# EAGLE design Ringer (EAGLE 9.6.2)
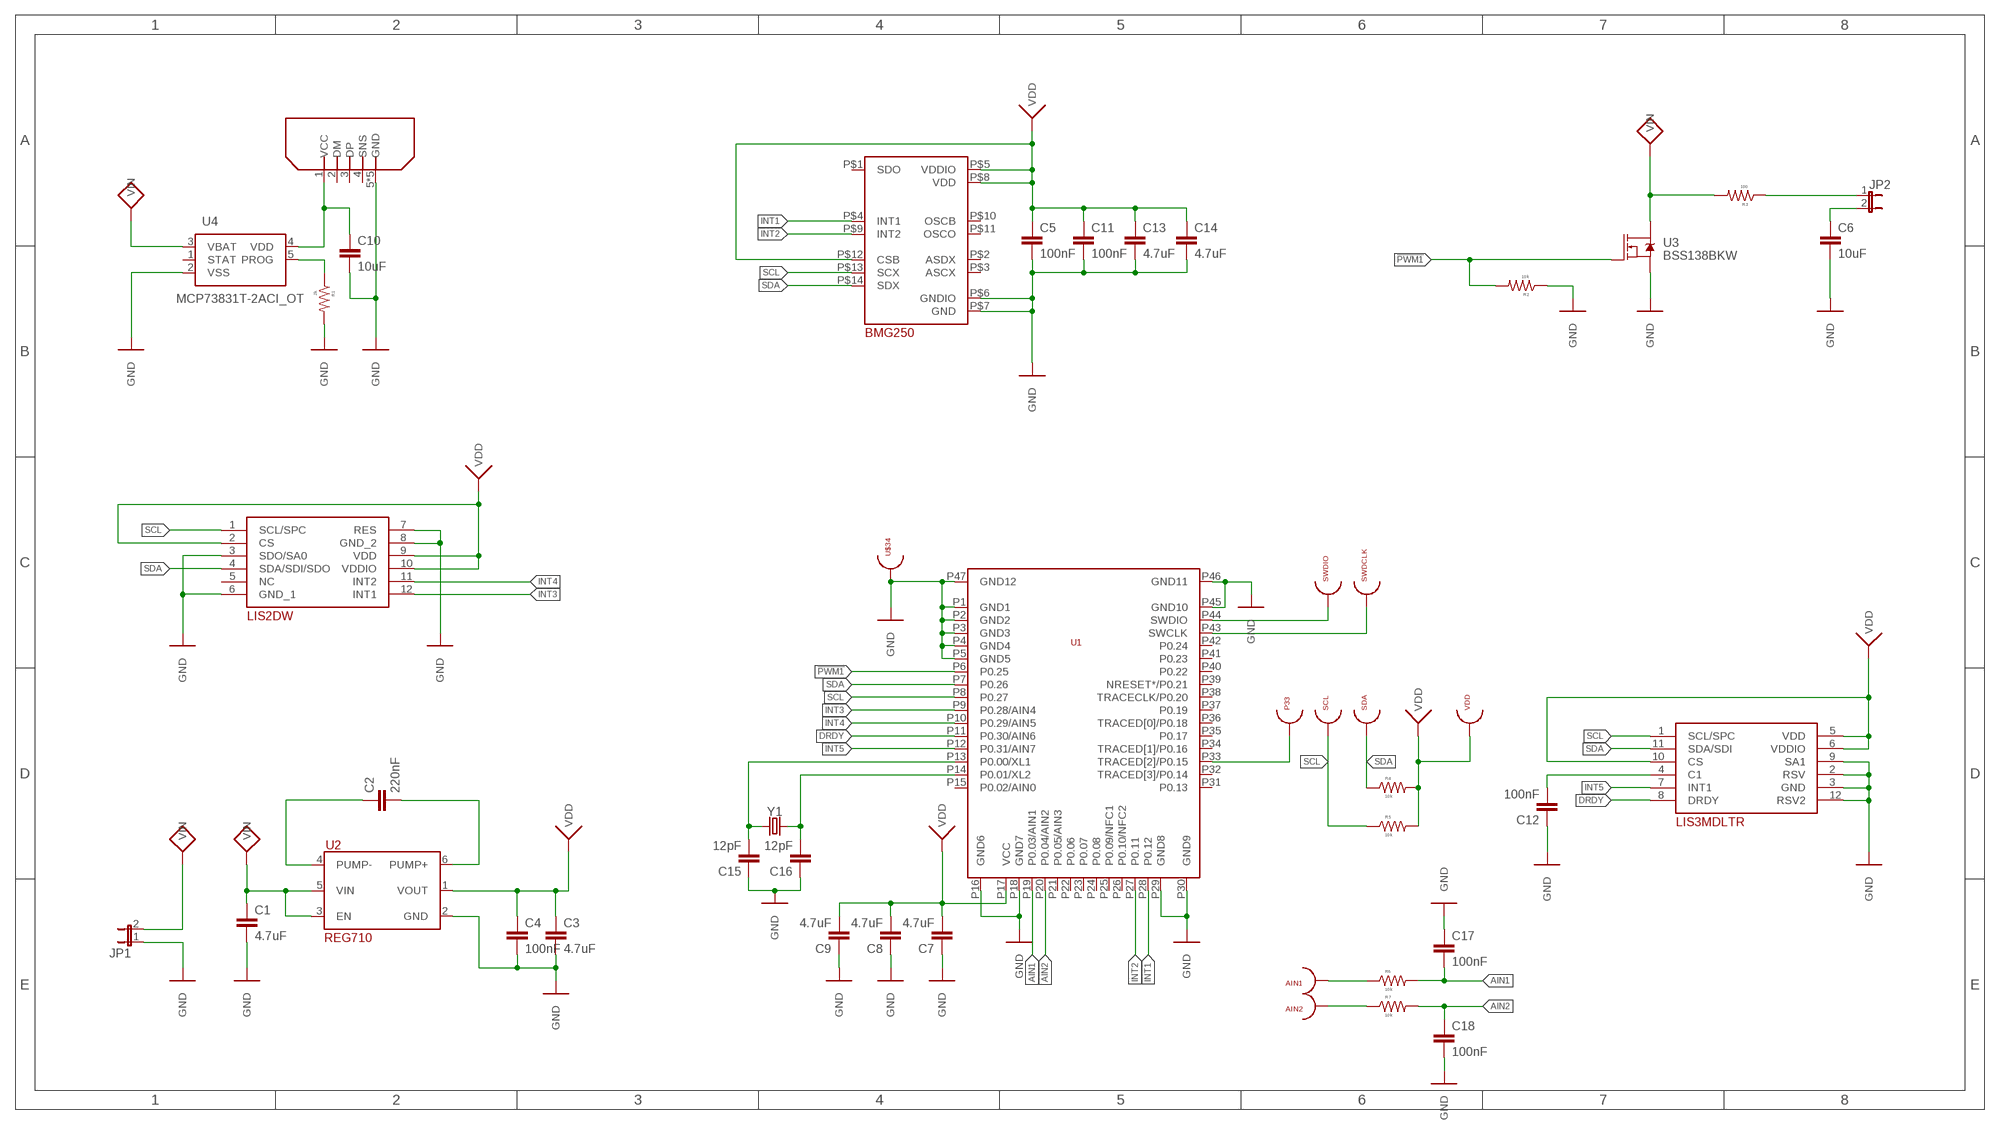
[diagram p0: schematic, sheet 1]

## Parts
AIN1  TESTPOINT_22  [TESTPOINT_22]
AIN2  TESTPOINT_22  [TESTPOINT_22]
C1  4.7uF  CAPACITOR0603  [C0603]
C2  220nF  CAPACITOR0603  [C0603]
C3  4.7uF  CAPACITOR0603  [C0603]
C4  100nF  CAPACITOR0603  [C0603]
C5  100nF  CAPACITOR0603  [C0603]
C6  10uF  CAPACITOR0805  [C0805]
C7  4.7uF  CAPACITOR0603  [C0603]
C8  4.7uF  CAPACITOR0603  [C0603]
C9  4.7uF  CAPACITOR0603  [C0603]
C10  10uF  CAPACITOR0603  [C0603]
C11  100nF  CAPACITOR0603  [C0603]
C12  100nF  CAPACITOR0603  [C0603]
C13  4.7uF  CAPACITOR0603  [C0603]
C14  4.7uF  CAPACITOR0603  [C0603]
C15  12pF  CAPACITOR0603  [C0603]
C16  12pF  CAPACITOR0603  [C0603]
C17  100nF  CAPACITOR0603  [C0603]
C18  100nF  CAPACITOR0603  [C0603]
IC1  LIS2DW12TR  [LGA-12]
JP1  JP1E  [JP1]
JP2  JP1E  [JP1]
P33  TESTPOINT_22  [TESTPOINT_22]
R1  2k  RESISTOR0603  [R0603]
R2  10k  RESISTOR0603  [R0603]
R3  100  RESISTOR0805  [R0805]
R4  10k  RESISTOR0603  [R0603]
R5  10k  RESISTOR0603  [R0603]
R6  10k  RESISTOR0603  [R0603]
R7  10k  RESISTOR0603  [R0603]
SCL  TESTPOINT_22  [TESTPOINT_22]
SDA  TESTPOINT_22  [TESTPOINT_22]
SWDCLK  TESTPOINT_22  [TESTPOINT_22]
SWDIO  TESTPOINT_22  [TESTPOINT_22]
U1  BMD-300  [BMD-300]
U2  REG710  [SOT457]
U3  BSS138BKW  [SOT65P210X110-3N]
U4  MCP73831T-2ACI_OT  [SOT95P270X145-5N]
U5  BMG250  [LGA14]
U$23  ZX80B5P  [ZX80B5P]
U$29  LIS3MDLTR  [LGA-12]
U$34  TESTPOINT_22  [TESTPOINT_22]
VDD  TESTPOINT_22  [TESTPOINT_22]
Y1  CRYSTALSMD-3.2X1.5  [CRYSTAL-SMD-3.2X1.5MM]

## Nets
!PWM1: R2.2 U1.P6(P0.25) U3.1(G)
AIN1: C17.2 R6.2 U1.P19(P0.03/AIN1)
AIN2: C18.1 R7.2 U1.P20(P0.04/AIN2)
DRDY: U1.P11(P0.30/AIN6) U$29.8(DRDY)
GND: C1.2 C3.2 C4.2 C5.2 C6.2 C7.1 C8.1 C9.1 C10.2 C11.2 C12.1 C13.2 C14.2 C15.1 C16.1 C17.1 C18.2 IC1.3(SDO/SA0) IC1.6(GND_1) IC1.7(RES) IC1.8(GND_2) JP1.1 R1.2 R2.1 U1.P1(GND1) U1.P2(GND2) U1.P3(GND3) U1.P4(GND4) U1.P5(GND5) U1.P16(GND6) U1.P18(GND7) U1.P29(GND8) U1.P30(GND9) U1.P45(GND10) U1.P46(GND11) U1.P47(GND12) U2.2(GND) U3.2(S) U4.2(VSS) U5.P$6(GNDIO) U5.P$7(GND) U$23.5(GND) U$23.GND1(GND) U$23.GND2(GND) U$23.GND3(GND) U$23.GND4(GND) U$29.2(RSV) U$29.3(GND) U$29.9(SA1) U$29.12(RSV2) U$34.P$1
INT1: U1.P28(P0.12) U5.P$4(INT1)
INT2: U1.P27(P0.11) U5.P$9(INT2)
INT3: IC1.12(INT1) U1.P9(P0.28/AIN4)
INT4: IC1.11(INT2) U1.P10(P0.29/AIN5)
INT5: U1.P12(P0.31/AIN7) U$29.7(INT1)
N$1: C6.1 JP2.2
N$2: JP2.1 R3.1
N$3: C2.1 U2.4(PUMP-)
N$4: C2.2 U2.6(PUMP+)
N$5: C10.1 U4.4(VDD) U$23.1(VCC)
N$6: C15.2 U1.P13(P0.00/XL1) Y1.P$1
N$7: R1.1 U4.5(PROG)
N$8: C12.2 U$29.4(C1)
N$9: C16.2 U1.P14(P0.01/XL2) Y1.P$2
N$10: P33.P$1 U1.P33(TRACED[2]/P0.15)
N$12: AIN2.P$1 R7.1
N$13: AIN1.P$1 R6.1
SCL: IC1.1(SCL/SPC) R5.1 SCL.P$1 U1.P8(P0.27) U5.P$13(SCX) U$29.1(SCL/SPC)
SDA: IC1.4(SDA/SDI/SDO) R4.1 SDA.P$1 U1.P7(P0.26) U5.P$14(SDX) U$29.11(SDA/SDI)
SWCLK: SWDCLK.P$1 U1.P43(SWCLK)
SWDIO: SWDIO.P$1 U1.P44(SWDIO)
VDD: C3.1 C4.1 C5.1 C7.2 C8.2 C9.2 C11.1 C13.1 C14.1 IC1.2(CS) IC1.9(VDD) IC1.10(VDDIO) R4.2 R5.2 U1.P17(VCC) U2.1(VOUT) U5.P$5(VDDIO) U5.P$8(VDD) U5.P$12(CSB) U$29.5(VDD) U$29.6(VDDIO) U$29.10(CS) VDD.P$1
VIN: C1.1 JP1.2 R3.2 U2.3(EN) U2.5(VIN) U3.3(D) U4.3(VBAT)
Unconnected: IC1.5(NC) U1.P15(P0.02/AIN0) U1.P21(P0.05/AIN3) U1.P22(P0.06) U1.P23(P0.07) U1.P24(P0.08) U1.P25(P0.09/NFC1) U1.P26(P0.10/NFC2) U1.P31(P0.13) U1.P32(TRACED[3]/P0.14) U1.P34(TRACED[1]/P0.16) U1.P35(P0.17) U1.P36(TRACED[0]/P0.18) U1.P37(P0.19) U1.P38(TRACECLK/P0.20) U1.P39(NRESET*/P0.21) U1.P40(P0.22) U1.P41(P0.23) U1.P42(P0.24) U4.1(STAT) U5.P$1(SDO) U5.P$2(ASDX) U5.P$3(ASCX) U5.P$10(OSCB) U5.P$11(OSCO) U$23.2(DM) U$23.3(DP) U$23.4(SNS)

## Library data of the parts
AIN1 AIN2 P33 SCL SDA SWDCLK SWDIO U$34 VDD = test_points:TESTPOINT_22
C1-C18 = Passives:CAPACITOR: Capacitor
IC1 = Accelerometers:LIS2DW12TR: Accelerometers MEMS digital output motion sensor:high-performance ultra-low-power 3-axis "femto" accelerometer Source: Datasheet <https://componentsearchengine.com/Datasheets/1/LIS2DW12TR.pdf>; DESCRIPTION: Accelerometers MEMS digital output motion sensor:high-performance ultra-low-power 3-axis "femto" accelerometer; HEIGHT: mm; MANUFACTURER_NAME: STMicroelectronics; MANUFACTURER_PART_NUMBER: LIS2DW12TR; MOUSER_PART_NUMBER: 511-LIS2DW12TR; MOUSER_PRICE-STOCK: https://www.mouser.com/Search/Refine.aspx?Keyword=511-LIS2DW12TR
JP1 JP2 = jumper:JP1E: JUMPER
R1-R7 = Passives:RESISTOR: Resistor
U1 = Rigado:BMD-300
U2 = DCDC:REG710: REG710xx Buck-Boost Charge Pump with up to 60-mA Output Current
U3 = BSS138:BSS138BKW: N-channel Trench MOSFET; MPN: BSS138BKW; OC_FARNELL: 2053836; OC_NEWARK: 61T7488; PACKAGE: SOT-23-3; SUPPLIER: NXP
U4 = Battery:MCP73831T-2ACI_OT: Li-Ion Charge Controller 4.2V SOT23-5 Source: Datasheet <http://ww1.microchip.com/downloads/en/DeviceDoc/20001984g.pdf>; DESCRIPTION: Li-Ion Charge Controller 4.2V SOT23-5; HEIGHT: 1.45mm; MANUFACTURER_NAME: Microchip; MANUFACTURER_PART_NUMBER: MCP73831T-2ACI/OT; MOUSER_PART_NUMBER: 579-MCP73831T-2ACIOT; MOUSER_PRICE-STOCK: https://www.mouser.co.uk/ProductDetail/Microchip-Technology/MCP73831T-2ACI-OT?qs=yUQqVecv4qvbBQBGbHx0Mw%3D%3D
U5 = Gyroscopes:BMG250
U$23 = USB:ZX80B5P
U$29 = Accelerometers:LIS3MDLTR: The LIS3MDL is an ultra-low-power highperformance three-axis magnetic sensor. The LIS3MDL has user-selectable full scales of ±4/8/12/16 gauss. The self-test capability allows the user to check the functioning of the sensor in the final application. The device may be configured to generate interrupt signals for magnetic field detection. The LIS3MDL includes an I2C serial bus interface that supports standard and fast mode (100 kHz and 400 kHz) and SPI serial standard interface. The LIS3MDL is available in a small thin plastic land grid array package (LGA) and is guaranteed to operate over an extended temperature range of -40 °C to +85 °C.
Y1 = SparkFun-Clocks:CRYSTAL: Crystals (Generic) These are passive quartz crystals, which can be used as a clock source for a microcontroller. Crystal's are two-terminal devices. They require external "load" capacitors to generate an oscillating signal.

## Board
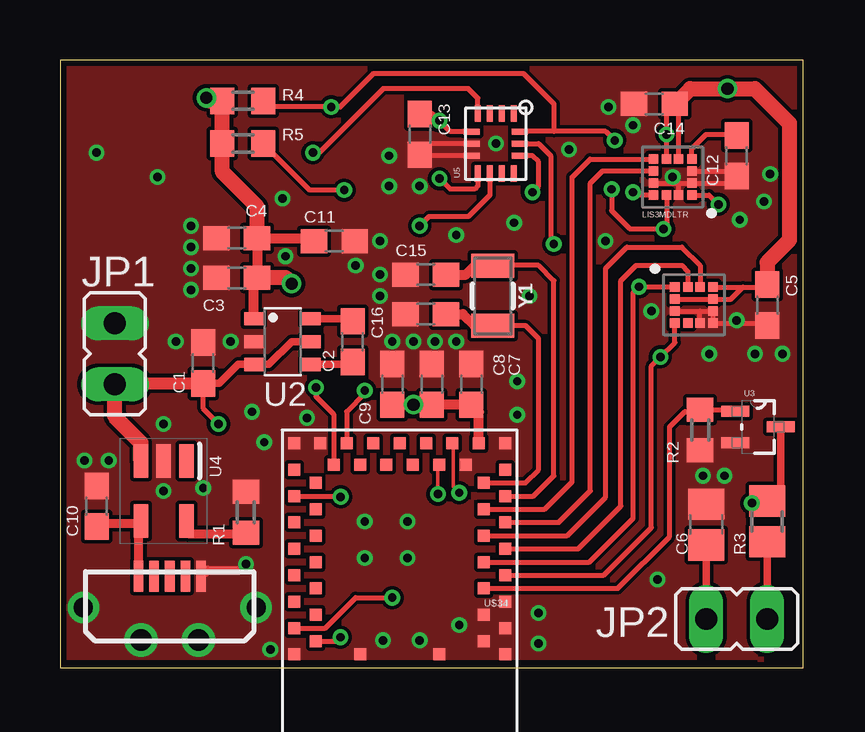
[diagram p1: board, top side]
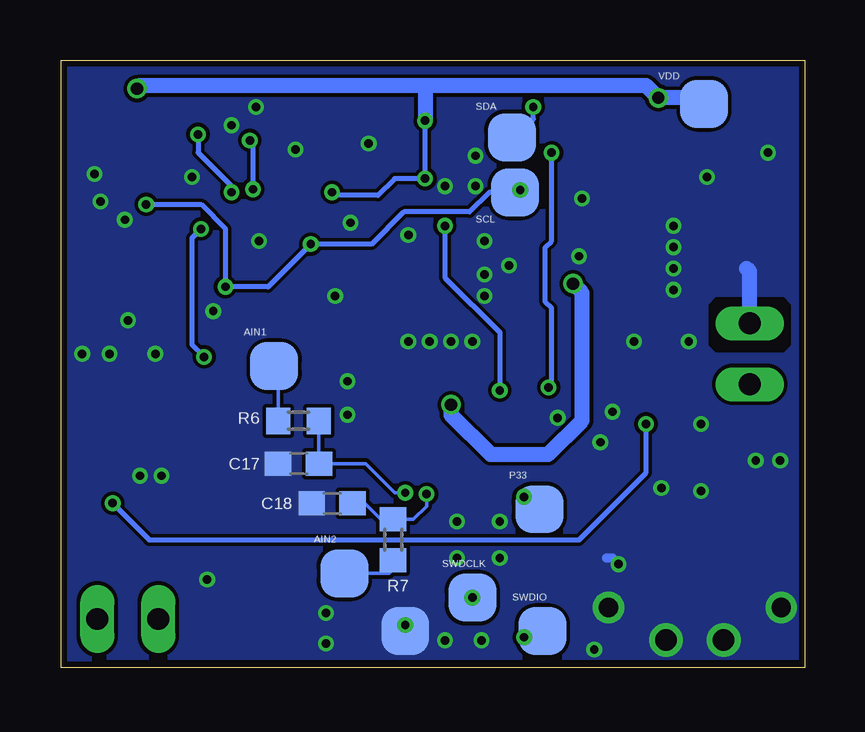
[diagram p2: board, bottom side, seen from below]

Size 30.97 x 25.32 mm. Coordinates in mm from the lower left corner, seen from the top.
Outline: 0,0 30.97,0 30.97,25.32 0,25.32 0,0
Copper layers (1*16): Top 0.035mm / dielectric 1.5mm / Bottom 0.035mm
Design rules "SeeedStudio_2layer_DRU_no_angle_20140221": minimum track width 6mil, minimum drill 12mil, track to track 6mil, track to pad 6mil, pad to pad 6mil, via to via 6mil, smd to smd 0mil, copper to edge 10mil, drill to drill 10mil, minimum pad ring 10mil, minimum via ring 6mil, stop-mask expansion 2mil, vias tented up to drill 100mil, thermal gap 10mil

### Footprints (pad centres in the part's own frame; a part is rotated, then mirrored left to right if it is on the bottom)
TESTPOINT_22 = smd 2 x 2: P$1 0,0
C0603 = smd 1.1 x 1: 1 -0.85,0; 2 0.85,0
C0805 = smd 1.3 x 1.5: 1 -0.85,0; 2 0.85,0
LGA-12 = smd 0.4 x 0.4: 1 -0.8,0.75; 2 -0.8,0.25; 3 -0.8,-0.25; 4 -0.8,-0.75; 5 -0.25,-0.75; 6 0.25,-0.75; 7 0.8,-0.75; 8 0.8,-0.25; 9 0.8,0.25; 10 0.8,0.75; 11 0.25,0.75; 12 -0.25,0.75
JP1 = drill 0.914 long: 1 0,-1.27; 2 0,1.27
R0603 = smd 1 x 1.1: 1 -0.85,0; 2 0.85,0
R0805 = smd 1.3 x 1.5: 1 -0.85,0; 2 0.85,0
BMD-300 = smd 0.5 x 0.5: P1 0.5,9.35; P2 1.4,8.8; P3 0.5,8.25; P4 1.4,7.7; P5 0.5,7.15; P6 1.4,6.6; P7 0.5,6.05; P8 1.4,5.5; P9 0.5,4.95; P10 1.4,4.4; P11 0.5,3.85; P12 1.4,3.3; P13 0.5,2.75; P14 1.4,2.2; P15 0.5,1.65; P16 0.5,0.55; P17 1.6,0.55; P18 2.15,1.45; P19 2.7,0.55; P20 3.25,1.45; P21 3.8,0.55; P22 4.35,1.45; P23 4.9,0.55; P24 5.45,1.45; P25 6,0.55; P26 6.55,1.45; P27 7.1,0.55; P28 7.65,1.45; P29 8.2,0.55; P30 9.3,0.55; P31 9.3,1.65; P32 8.4,2.2; P33 9.3,2.75; P34 8.4,3.3; P35 9.3,3.85; P36 8.4,4.4; P37 9.3,4.95; P38 8.4,5.5; P39 9.3,6.05; P40 8.4,6.6; P41 9.3,7.15; P42 8.4,7.7; P43 9.3,8.25; P44 8.4,8.8; P45 9.3,9.35; P46 6.55,9.35; P47 3.25,9.35
SOT457 = smd 0.55 x 0.8: 1 -0.95,-1.2; 2 0,-1.2; 3 0.95,-1.2; 4 0.95,1.2; 5 0,1.2; 6 -0.95,1.2
SOT65P210X110-3N = smd 1.168 x 0.457: 1 -0.94,0.66; 2 -0.94,-0.66; 3 0.94,0
SOT95P270X145-5N = smd 1.4 x 0.6: 1 -1.25,0.95; 2 -1.25,0; 3 -1.25,-0.95; 4 1.25,-0.95; 5 1.25,0.95
LGA14 = smd 0.675 x 0.25: P$1 -1.25,0.75; P$2 -1.25,0.25; P$3 -1.25,-0.25; P$4 -1.25,-0.75; P$8 1.25,-0.75; P$9 1.25,-0.25; P$10 1.25,0.25; P$11 1.25,0.75 | smd 0.25 x 0.675: P$5 -0.5,-1; P$6 0,-1; P$7 0.5,-1; P$12 0.5,1; P$13 0,1; P$14 -0.5,1
ZX80B5P = smd 0.4 x 1.3: 1 -1.3,0; 2 -0.65,0; 3 0,0; 4 0.65,0; 5 1.3,0 | drill 0.8: GND1 3.6,-1.3; GND4 -3.6,-1.3 | drill 0.9: GND2 -1.2,-2.65; GND3 1.2,-2.65
CRYSTAL-SMD-3.2X1.5MM = smd 1 x 1.8: P$1 -1.25,0; P$2 1.25,0

### Placement (x,y rotation side)
AIN1  22.1,12.57 0 bottom
AIN2  19.18,3.94 0 bottom
C1  5.97,12.7 90 top
C2  12.19,13.59 90 top
C3  7.37,16.26 180 top
C4  7.37,17.91 180 top
C5  29.46,15.11 270 top
C6  26.92,5.97 90 top
C7  17.14,11.81 270 top
C8  15.49,11.81 270 top
C9  13.84,11.81 270 top
C10  1.52,6.73 90 top
C11  11.43,17.78 0 top
C12  28.19,21.34 90 top
C13  14.99,22.23 270 top
C14  24.77,23.5 180 top
C15  15.24,16.38 0 top
C16  15.24,14.73 0 top
C17  21.08,8.51 0 bottom
C18  19.68,6.86 180 bottom
IC1  26.42,15.11 0 top
JP1  2.29,13.08 180 top
JP2  28.19,2.03 90 top
P33  11.05,6.6 0 bottom
R1  7.75,6.48 90 top
R2  26.67,9.91 90 top
R3  29.46,6.1 90 top
R4  7.62,23.62 180 top
R5  7.62,21.84 180 top
R6  21.08,10.29 0 bottom
R7  17.14,5.33 90 bottom
SCL  12.06,19.81 0 bottom
SDA  12.19,22.1 0 bottom
SWDCLK  13.84,2.92 0 bottom
SWDIO  10.92,1.52 0 bottom
U1  19.05,9.91 180 top
U2  9.27,13.59 270 top
U3  29.08,10.03 0 top
U4  4.32,7.37 270 top
U5  18.16,21.84 270 top
U$23  4.57,3.81 0 top
U$29  25.53,20.45 180 top
U$34  16.64,1.52 0 bottom
VDD  4.19,23.5 0 bottom
Y1  18.03,15.49 270 top

### Tracks (layer width: path | path; a pad name or v marks a point on that pad's centre or on a via)
!PWM1
  Top 0.203: U1.P6 23.25,3.31 25.4,5.46 25.4,10.03 26.04,10.67 26.58,10.67 R2.2 28.08,10.76 U3.1
AIN1  (via drill 0.35)
  Top 0.152: U1.P19 16.38,9.32 16.38,7.54 v16.64,7.29
  Bottom 0.152: v16.64,7.29 17.07,7.29 18.29,8.51 C17.2 R6.2
AIN2  (via drill 0.35)
  Top 0.152: v15.75,7.24 15.75,8.4 U1.P20
  Bottom 0.152: v15.75,7.24 15.75,6.73 16.3,6.18 R7.2 17.65,6.18 18.33,6.86 C18.1
DRDY
  Top 0.203: U1.P11 20.79,6.06 22.1,7.37 22.1,20.19 22.61,20.7 U$29.8
GND  (via drill 0.35)
  Top 0.203: IC1.3 26.67,14.86 | 26.67,14.86 IC1.8 IC1.7 29.36,14.36 C5.2 | IC1.6 26.67,14.86 | U$29.3 27.98,20.7 C12.1 27.91,20.2 U$29.2 25.78,20.2 | U$29.9 25.78,20.2 | U$29.12 25.78,20.2 | U5.P$6 15.46,21.84 C13.2 15.02,21.34 U5.P$7
  Top 0.381: U$23.5 6.13,4.06 7.49,4.06 v7.75,4.32
  Bottom 0.381: v7.75,4.32 8,4.57 8.26,4.57
  Bottom 0.635: JP1.1 2.29,16.51 2.41,16.64
  other vias: 26.8,8 27.69,8 30.1,13.08 28.96,13.08 27.05,13.08 29.59,20.57 29.34,19.43 28.32,18.67 22.86,23.37 23.88,22.61 13.72,21.34 13.72,20.07 14.99,20.07 16.51,13.59 15.62,13.59 14.73,13.59 13.84,13.59 5.46,18.41 5.46,17.53 5.46,16.64 13.34,17.78 12.32,16.76 5.46,15.75 7.11,13.59 4.83,13.59 5.97,7.49 4.32,7.37 1.02,8.64 8.76,0.76 13.46,1.14 14.99,1.14 19.94,2.29 19.94,1.02 16.64,1.78 14.48,6.1 19.05,10.54 10.29,10.41 8,10.67 18.92,18.54 16.51,18.03 4.06,20.45 13.34,16.38 13.34,15.49 8.51,9.4 4.32,10.16 22.73,17.78 2.03,8.64 12.7,6.1 14.48,4.57 12.7,4.57 24.89,3.68 19.05,11.94 9.27,19.56 21.21,21.59 1.52,21.46 19.56,15.49 9.4,17.14 24.64,14.86 18.16,21.84 25.53,20.45 28.19,14.48
  pour Bottom (no thermals): -1.78,-1.14 -1.78,26.16 -0.64,27.3 31.88,27.3 33.66,25.53 33.66,-1.4 31.88,-3.17 0.25,-3.17
  pour Top (no thermals): -1.52,-1.4 -1.52,25.91 -0.38,27.05 32.13,27.05 33.91,25.27 33.91,-1.65 32.13,-3.43 0.51,-3.43
  cutout Bottom: 0.64,13.46 0.64,15.11 0.89,15.37 3.68,15.37 3.94,15.11 3.94,13.46 3.68,13.21 0.89,13.21
INT1  (via drill 0.35)
  Top 0.203: U5.P$4 17.41,23.74 17.02,24.13 13.46,24.13 10.79,21.46 v10.54,21.46 | v10.67,11.68 10.67,11.3 11.4,10.57 U1.P28
  Bottom 0.203: v10.67,11.68 10.54,11.81 10.54,14.99 10.79,15.24 10.79,17.53 10.54,17.78 v10.54,21.46
INT2  (via drill 0.35)
  Top 0.203: U5.P$9 17.91,19.69 17.02,18.8 15.37,18.8 v14.99,18.41 | v12.7,11.56 12.7,11.43 11.94,10.67 11.94,9.37 U1.P27
  Bottom 0.203: v14.99,18.41 14.99,16.26 12.7,13.97 v12.7,11.56
INT3
  Top 0.203: U1.P9 21.59,4.96 23.37,6.73 23.37,16.13 24,16.76 25.91,16.76 26.17,16.51 IC1.12
INT4
  Top 0.203: U1.P10 21.13,5.51 22.73,7.11 22.73,16.64 23.62,17.53 25.91,17.53 26.67,16.76 IC1.11
INT5
  Top 0.203: U1.P12 20.2,6.61 21.34,7.75 21.34,20.45 22.09,21.2 U$29.7
N$1
  Top 0.305: C6.1 JP2.2
N$2
  Top 0.305: R3.1 JP2.1
N$3
  Top 0.305: U2.4 12.09,12.64 C2.1
N$4
  Top 0.305: U2.6 12.09,14.54 C2.2
N$5
  Top 0.381: U$23.1 3.27,6.02 | 3.27,6.02 U4.4 | C10.1 1.66,6.02 3.27,6.02
N$6
  Top 0.203: U1.P13 19.73,7.16 20.57,8 20.57,16.13 19.94,16.76 18.05,16.76 | 18.05,16.76 17.29,16.76 | 18.05,16.76 Y1.P$1
  Top 0.406: 17.29,16.76 16.91,16.38 C15.2
N$7
  Top 0.381: U4.5 5.33,6.05 5.33,5.59 7.71,5.59 R1.1
N$8
  Top 0.203: U$29.4 26.33,21.63 26.92,22.23 28.16,22.23 C12.2
N$9
  Top 0.203: U1.P14 19.39,7.71 19.94,8.26 19.94,13.72 19.41,14.24 18.29,14.24 Y1.P$2 17.27,14.24
  Top 0.406: C16.2 16.78,14.73 17.27,14.24
N$10  (via drill 0.35)
  Top 0.203: U1.P33 11.66,7.16 v11.69,7.12
  Bottom 0.203: v11.69,7.12 11.57,7.12 P33.P$1
N$12
  Bottom 0.152: AIN2.P$1 17.31,3.94 17.14,4.1 R7.1
N$13
  Bottom 0.152: R6.1 21.93,12.41 AIN1.P$1
SCL  (via drill 0.35)
  Top 0.203: U1.P8 22.06,4.41 23.88,6.22 23.88,15.62 v24.13,15.88 25.6,15.88 IC1.1 | v27.43,19.3 27.04,19.7 U$29.1 | U5.P$13 19.94,21.84 20.45,21.34 20.45,17.78 v20.57,17.65 | R5.1 10.41,19.91 v11.84,19.91
  Bottom 0.203: v27.43,19.3 25.15,19.3 24.13,18.29 v24.13,15.88 22.35,15.88 v20.57,17.65 18.03,17.65 16.69,19 13.96,19 13.15,19.81 SCL.P$1 11.97,19.91 v11.84,19.91
SDA  (via drill 0.35)
  Top 0.203: U1.P7 22.65,3.86 24.64,5.84 24.64,12.57 v25.02,12.95 25.62,13.55 IC1.4 | U$29.11 25.28,18.42 v25.15,18.29 23.75,18.29 22.99,19.05 v22.99,19.94 | 20.57,22.35 22.73,22.35 v23.11,21.97 | 20.57,22.35 U5.P$14 | R4.1 8.72,23.37 v11.3,23.37 11.68,23.37 13.08,24.77 19.3,24.77 20.57,23.5 20.57,22.35
  Bottom 0.203: v25.15,18.29 25.53,17.91 25.53,13.46 v25.02,12.95 | v23.11,21.97 22.99,21.84 v22.99,19.94 | v11.3,23.37 11.3,22.86 11.94,22.23 12.07,22.1 SDA.P$1
SWCLK  (via drill 0.35)
  Top 0.203: U1.P43 11.05,1.66 12.32,2.92 SWDCLK.P$1
  other vias: 13.84,2.92
SWDIO  (via drill 0.35)
  Top 0.203: U1.P44 11.52,1.11 v11.68,1.27
  Bottom 0.203: SWDIO.P$1 11.18,1.27 v11.68,1.27
VDD  (via drill 0.35, 0.51)
  Top 0.203: IC1.10 28.45,15.86 | 28.45,15.86 29.36,15.86 C5.1 | IC1.2 IC1.9 27.95,15.36 28.45,15.86 | U$29.6 v25.27,22.23 25.27,23.15 25.57,23.45 | 25.57,23.45 C14.1 | U$29.5 25.78,23.25 25.57,23.45 | U5.P$5 16.26,22.34 v15.81,22.8 15.53,23.07 C13.1 | U$29.10 23.99,19.7 v23.88,19.81 | U5.P$8 17.41,20.08 17.27,19.94 16.26,19.94 v15.81,20.38 | v19.68,19.81 19.94,20.07 19.94,21.08 19.68,21.34 U5.P$12
  Top 0.406: U1.P17 17.45,10.66 C7.2 C8.2 v14.73,10.96 C9.2 | C11.1 10.45,17.91 C4.1 C3.1 8.07,16.11 U2.1
  Top 0.635: C4.1 8.22,19.22 6.77,20.66 R5.2 R4.2 6.22,23.62 v6.1,23.75 | C14.1 26.25,24.13 v27.81,24.13 28.96,24.13 30.39,22.7 30.39,17.82 29.46,16.89 C5.1 | v9.65,16 9.4,16.26 C3.1
  Bottom 0.203: v23.88,19.81 23.88,20.07 25.27,21.46 v25.27,22.23 | v15.81,22.8 v15.81,20.38 17.08,20.38 17.78,19.68 19.56,19.68 v19.68,19.81
  Bottom 0.635: v14.73,10.96 14.73,10.54 13.08,8.89 10.68,8.89 9.27,10.3 9.27,15.62 v9.65,16 | v27.81,24.13 27.69,24.26 15.75,24.26 | 15.75,24.26 6.6,24.26 v6.1,23.75 4.45,23.75 VDD.P$1 | 15.75,24.26 15.81,24.19 v15.81,22.8
VIN  (via drill 0.36)
  Top 0.203: R3.2 29.38,6.86 v28.83,6.86 | v6.6,10.16 5.97,10.79 C1.1
  Top 0.305: C1.1 6.64,11.85 7.43,12.64 U2.3 8.7,12.64 9.65,13.59 U2.5 | U3.3 30.02,7.5 R3.2
  Top 0.508: JP1.2 2.33,11.85 C1.1
  Top 0.635: U4.3 3.37,9.38 2.29,10.46 JP1.2
  Bottom 0.203: v28.83,6.86 27.3,5.33 9.4,5.33 6.6,8.13 v6.6,10.16